# EAGLE design MAG3110_Breakout (EAGLE 6.5.0)
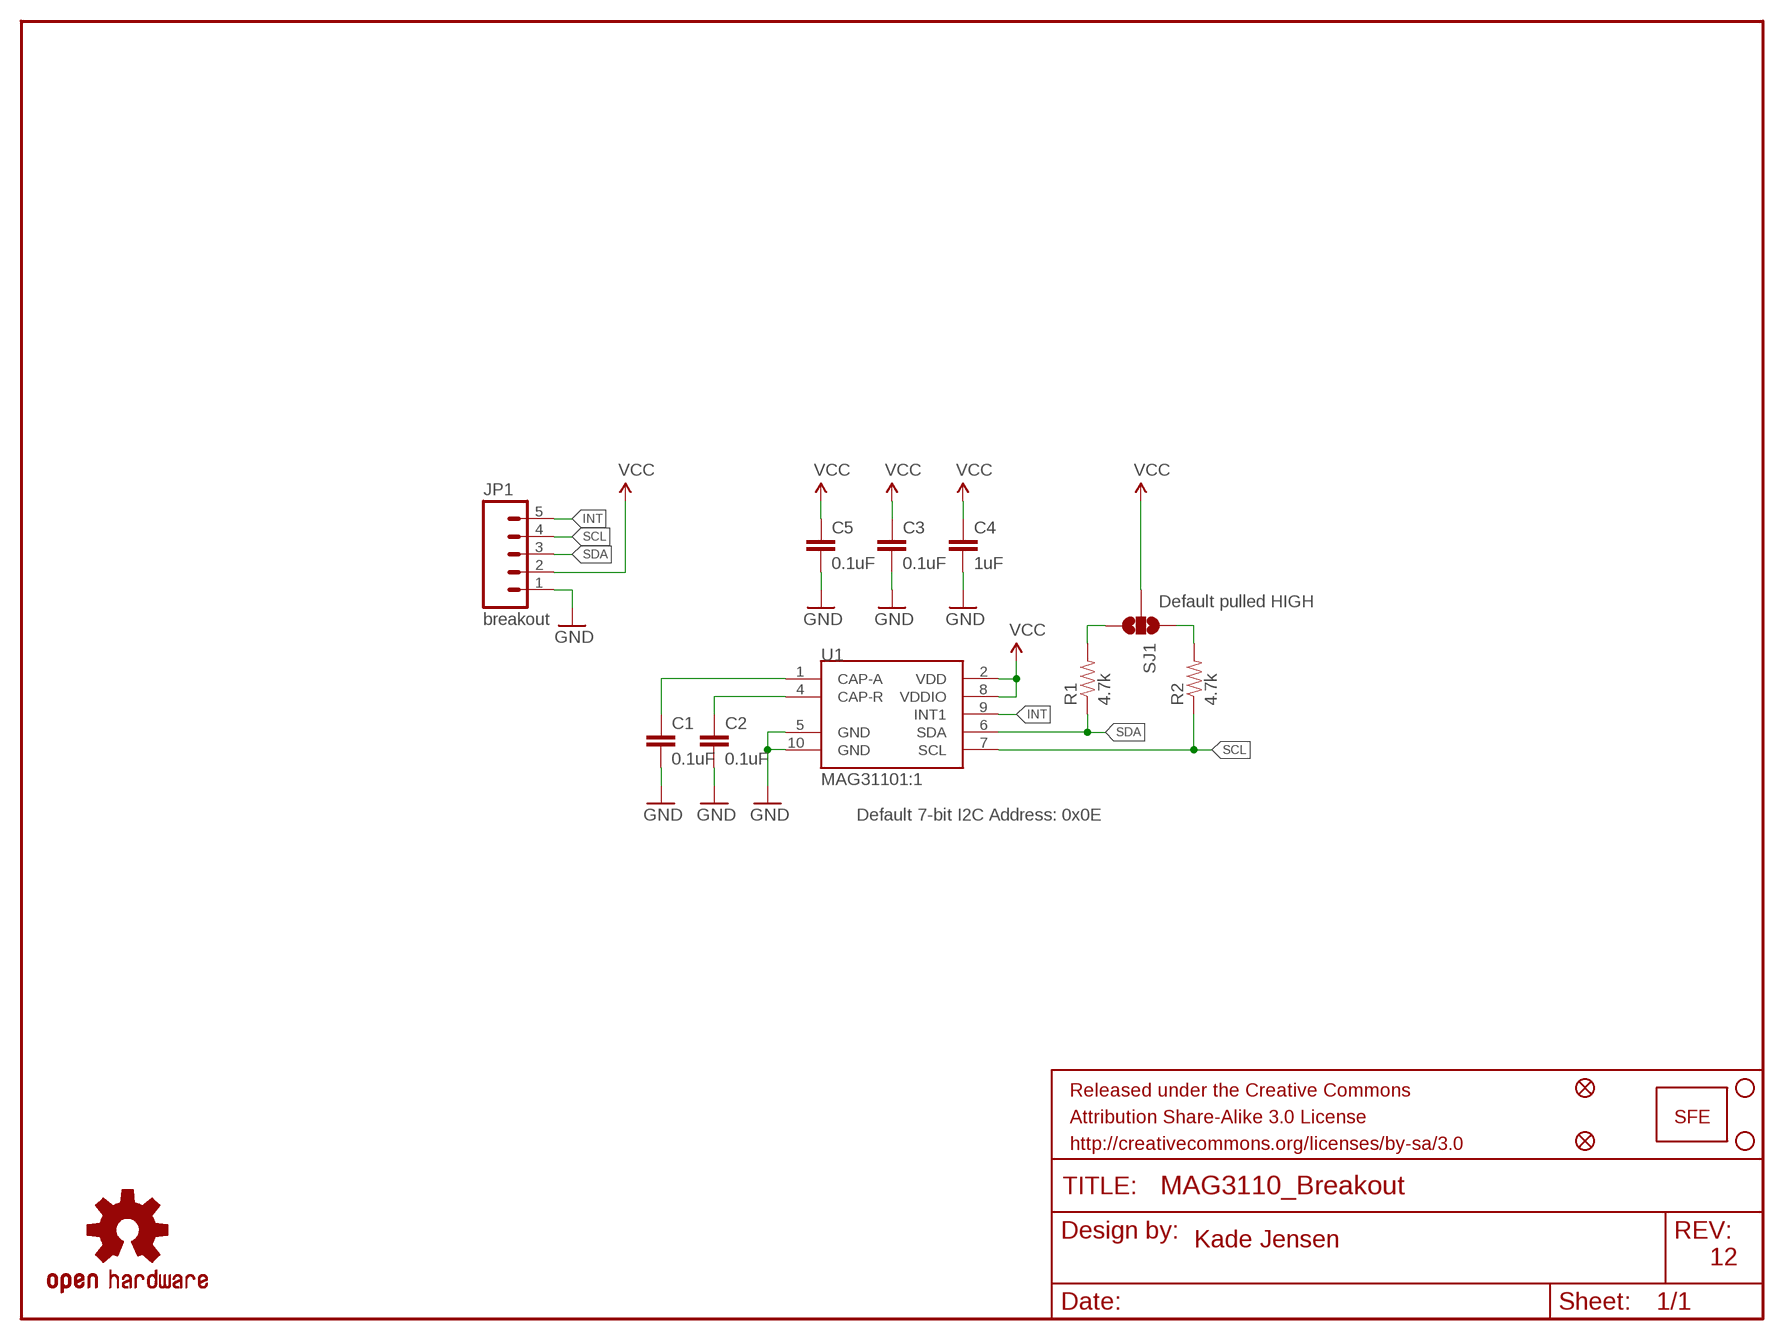
[diagram p0: schematic, sheet 1]

## Parts
C1  0.1uF  CAP0603-CAP  [0603-CAP]
C2  0.1uF  CAP0603-CAP  [0603-CAP]
C3  0.1uF  CAP0603-CAP  [0603-CAP]
C4  1uF  CAP0603-CAP  [0603-CAP]
C5  0.1uF  CAP0603-CAP  [0603-CAP]
FID1  FIDUCIAL1X2  [FIDUCIAL-1X2]
FID2  FIDUCIAL1X2  [FIDUCIAL-1X2]
FRAME2  FRAME-LETTER  [CREATIVE_COMMONS]
JP1  breakout  M05PTH  [1X05]
JP2  STAND-OFF  [STAND-OFF]
JP3  STAND-OFF  [STAND-OFF]
JP7  LOGO-SFESK  [SFE-LOGO-FLAME]
LOGO1  OSHW-LOGOS  [OSHW-LOGO-S]
R1  4.7k  RESISTOR0603-RES  [0603-RES]
R2  4.7k  RESISTOR0603-RES  [0603-RES]
SJ1  SOLDERJUMPER_2WAYPASTE1&2&3  [SJ_3_PASTE1&2&3]
U1  MAG31101:1  [DFN-10-W]

## Nets
GND: C1.2 C2.2 C3.2 C4.2 C5.2 JP1.1 U1.5(GND) U1.10(GND)
INT: JP1.5 U1.9(INT1)
N$1: C2.1 U1.4(CAP-R)
N$2: C1.1 U1.1(CAP-A)
N$3: R2.2 SJ1.1
N$4: R1.2 SJ1.3
SCL: JP1.4 R2.1 U1.7(SCL)
SDA: JP1.3 R1.1 U1.6(SDA)
VCC: C3.1 C4.1 C5.1 JP1.2 SJ1.2 U1.2(VDD) U1.8(VDDIO)

## Notes on the sheet
- Default pulled HIGH
- Default 7-bit I2C Address: 0x0E
- Kade Jensen
- 12

## Library data of the parts
C1-C5 = SparkFun:CAP: Capacitor Standard 0603 ceramic capacitor, and 0.1" leaded capacitor.
FID1 FID2 = SparkFun-Aesthetics:FIDUCIAL: Fiducial Alignment Points Various fiducial points for machine vision alignment.
FRAME2 = SparkFun-Aesthetics:FRAME-LETTER: Schematic Frame Standard 8.5x11 US Letter frame
JP1 = SparkFun:M05: Header 5 Standard 5-pin 0.1" header. Use with straight break away headers (SKU : PRT-00116), right angle break away headers (PRT-00553), swiss pins (PRT-00743), machine pins (PRT-00117), and female headers (PRT-00115). Molex polarized connector foot print use with SKU : PRT-08230 with associated crimp pins and housings.
JP2 JP3 = SparkFun:STAND-OFF: Stand Off This is the mechanical footprint for a #4 phillips button head screw. Use the keepout ring to avoid running the screw head into surrounding components. SKU : PRT-00447
JP7 = SparkFun:LOGO-SFE: Spark Fun Electronics PCB Logo This is the standard Spark Fun Electronics PCB logo.
LOGO1 = SparkFun-Aesthetics:OSHW-LOGO: Open Source Hardware Logo This logo indicates the piece of hardware it is found on incorporates a OSHW license and/or adheres to the definition of open source hardware found here: http://freedomdefined.org/OSHW
R1 R2 = SparkFun:RESISTOR: Resistor Basic schematic elements and footprints for 0603, 1206, and PTH resistors.
SJ1 = SparkFun-Passives:SOLDERJUMPER_2WAY: Solder Jumper 2 way solder jumper
U1 = SparkFun-Sensors:MAG3110: 3-axis digital (I2C) magnetometer

## Board
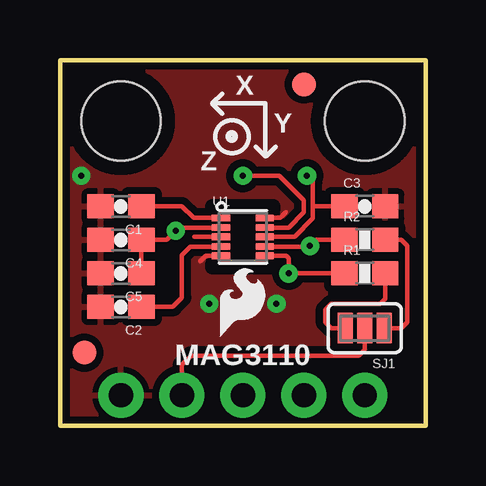
[diagram p1: board, top side]
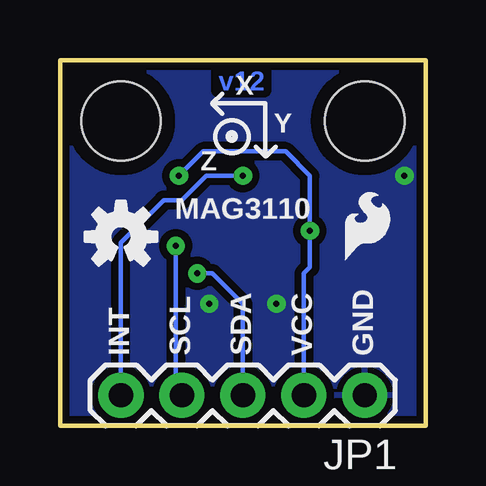
[diagram p2: board, bottom side, seen from below]

Size 15.24 x 15.24 mm. Coordinates in mm from the lower left corner, seen from the top.
Outline: 0,0 15.24,0 15.24,15.24 0,15.24 0,0
Copper layers (1*16): Top 0.035mm / dielectric 1.5mm / Bottom 0.035mm
Design rules "SparkFun-2-layer *": minimum track width 7mil, minimum drill 10mil, track to track 8mil, track to pad 8mil, pad to pad 8mil, via to via 8mil, smd to smd 8mil, copper to edge 8mil, drill to drill 8mil, minimum pad ring 12mil, minimum via ring 10mil, stop-mask expansion 4mil, vias tented up to drill 20mil, thermal gap 10mil
tRestrict: area 7.2,6.9 to 8,8.9; area 6.3,9 to 8.9,9.1; area 6.3,6.6 to 8.9,6.7

### Footprints (pad centres in the part's own frame; a part is rotated, then mirrored left to right if it is on the bottom)
0603-CAP = smd 1.1 x 1: 1 -0.85,0; 2 0.85,0
FIDUCIAL-1X2 = smd 1 x 1: 1 0,0
1X05 = drill 1.016 pad 1.88: 1 0,0; 2 2.54,0; 3 5.08,0; 4 7.62,0; 5 10.16,0
STAND-OFF = hole 3.302: 0,0
0603-RES = smd 1.1 x 1: 1 -0.85,0; 2 0.85,0
SJ_3_PASTE1&2&3 = smd 0.635 x 1.27: 1 -0.813,0; 2 0,0; 3 0.813,0
DFN-10-W = smd 0.762 x 0.279: 1 -0.91,0.787; 2 -0.91,0.381; 3 -0.91,0; 4 -0.91,-0.406; 5 -0.91,-0.787; 6 0.91,-0.787; 7 0.91,-0.406; 8 0.91,0; 9 0.91,0.381; 10 0.91,0.787

### Placement (x,y rotation side)
C1  2.54,9.14 180 top
C2  2.54,4.95 180 top
C3  12.7,9.14 0 top
C4  2.54,7.75 180 top
C5  2.54,6.35 180 top
FID1  1.02,3.05 0 top
FID2  10.16,14.22 0 top
FRAME2  -13.97,-8.89 0 top  (outside the outline)
JP1  2.54,1.27 180 bottom
JP2  2.54,12.7 0 top
JP3  12.7,12.7 0 top
JP4  LOGO-SFESK  [SFE-LOGO-FLAME]  3.35,6.91 0 bottom
JP7  6.68,3.73 0 top
LOGO1  12.7,7.87 0 bottom
R1  12.7,6.35 0 top
R2  12.7,7.75 0 top
SJ1  12.7,4.06 180 top
U1  7.62,7.87 0 top

### Tracks (layer width: path | path; a pad name or v marks a point on that pad's centre or on a via)
GND  (via drill 0.25)
  Top 0.178: U1.5 6.07,7.09 5.84,6.86 | U1.10 9.17,8.66 9.4,8.89
  other vias: 0.89,10.41 9.02,5.08 6.22,5.08
  pour Bottom (isolate 0.305): 0,15.24 0,0 15.24,0 15.24,15.24
  pour Top (isolate 0.305): 0,15.24 0,0 15.24,0 15.24,15.24
INT  (via drill 0.25)
  Top 0.178: v7.62,10.41 9.14,10.41 10.16,9.4 10.16,8.89 9.53,8.26 U1.9
  Bottom 0.178: JP1.5 12.7,7.62 10.92,9.4 10.16,9.4 9.14,10.41 v7.62,10.41
N$1
  Top 0.178: C2.1 4.7,4.95 5.08,5.33 5.08,7.11 5.44,7.47 U1.4
N$2
  Top 0.178: C1.1 5.08,9.14 5.56,8.66 U1.1
N$3
  Top 0.178: R2.2 14.22,7.75 14.48,7.49 14.48,4.32 14.22,4.06 SJ1.1
N$4
  Top 0.178: R1.2 13.55,5.29 13.34,5.08 11.3,5.08 11.05,4.83 11.05,4.32 11.3,4.06 SJ1.3
N$5
  Top 0.178: 5.59,7.87 6.73,7.87
SCL  (via drill 0.25)
  Top 0.178: U1.7 10.39,7.47 v10.41,7.49 10.67,7.75 R2.1
  Bottom 0.178: v10.41,7.49 10.41,1.52 JP1.4
SDA  (via drill 0.25)
  Top 0.178: U1.6 9.42,7.09 9.53,6.99 v9.53,6.35 R1.1
  Bottom 0.178: v9.53,6.35 8.89,6.35 7.62,5.08 JP1.3
VCC  (via drill 0.25)
  Top 0.178: C5.1 C4.1 4.45,7.75 v4.83,8.13 4.95,8.26 U1.2 | 10.54,9.14 10.54,8.64 9.78,7.87 U1.8 | C3.1 10.54,9.14 | 10.54,9.14 10.54,10.16 v10.29,10.41 | SJ1.2 12.7,3.17 12.45,2.92 5.46,2.92 5.08,2.54 JP1.2
  Bottom 0.178: v10.29,10.41 9.27,11.43 5.84,11.43 4.83,10.41 v4.83,8.13 4.83,6.6 5.08,6.35 JP1.2

### Text on the board
Bottom: v12
tPlace: X | Y | Z | MAG3110
bPlace: X | Y | Z | MAG3110 | GND | VCC | SDA | SCL | INT
tDocu: Kade Jensen